# Altium schematic sheet devices.SchDoc
size A3
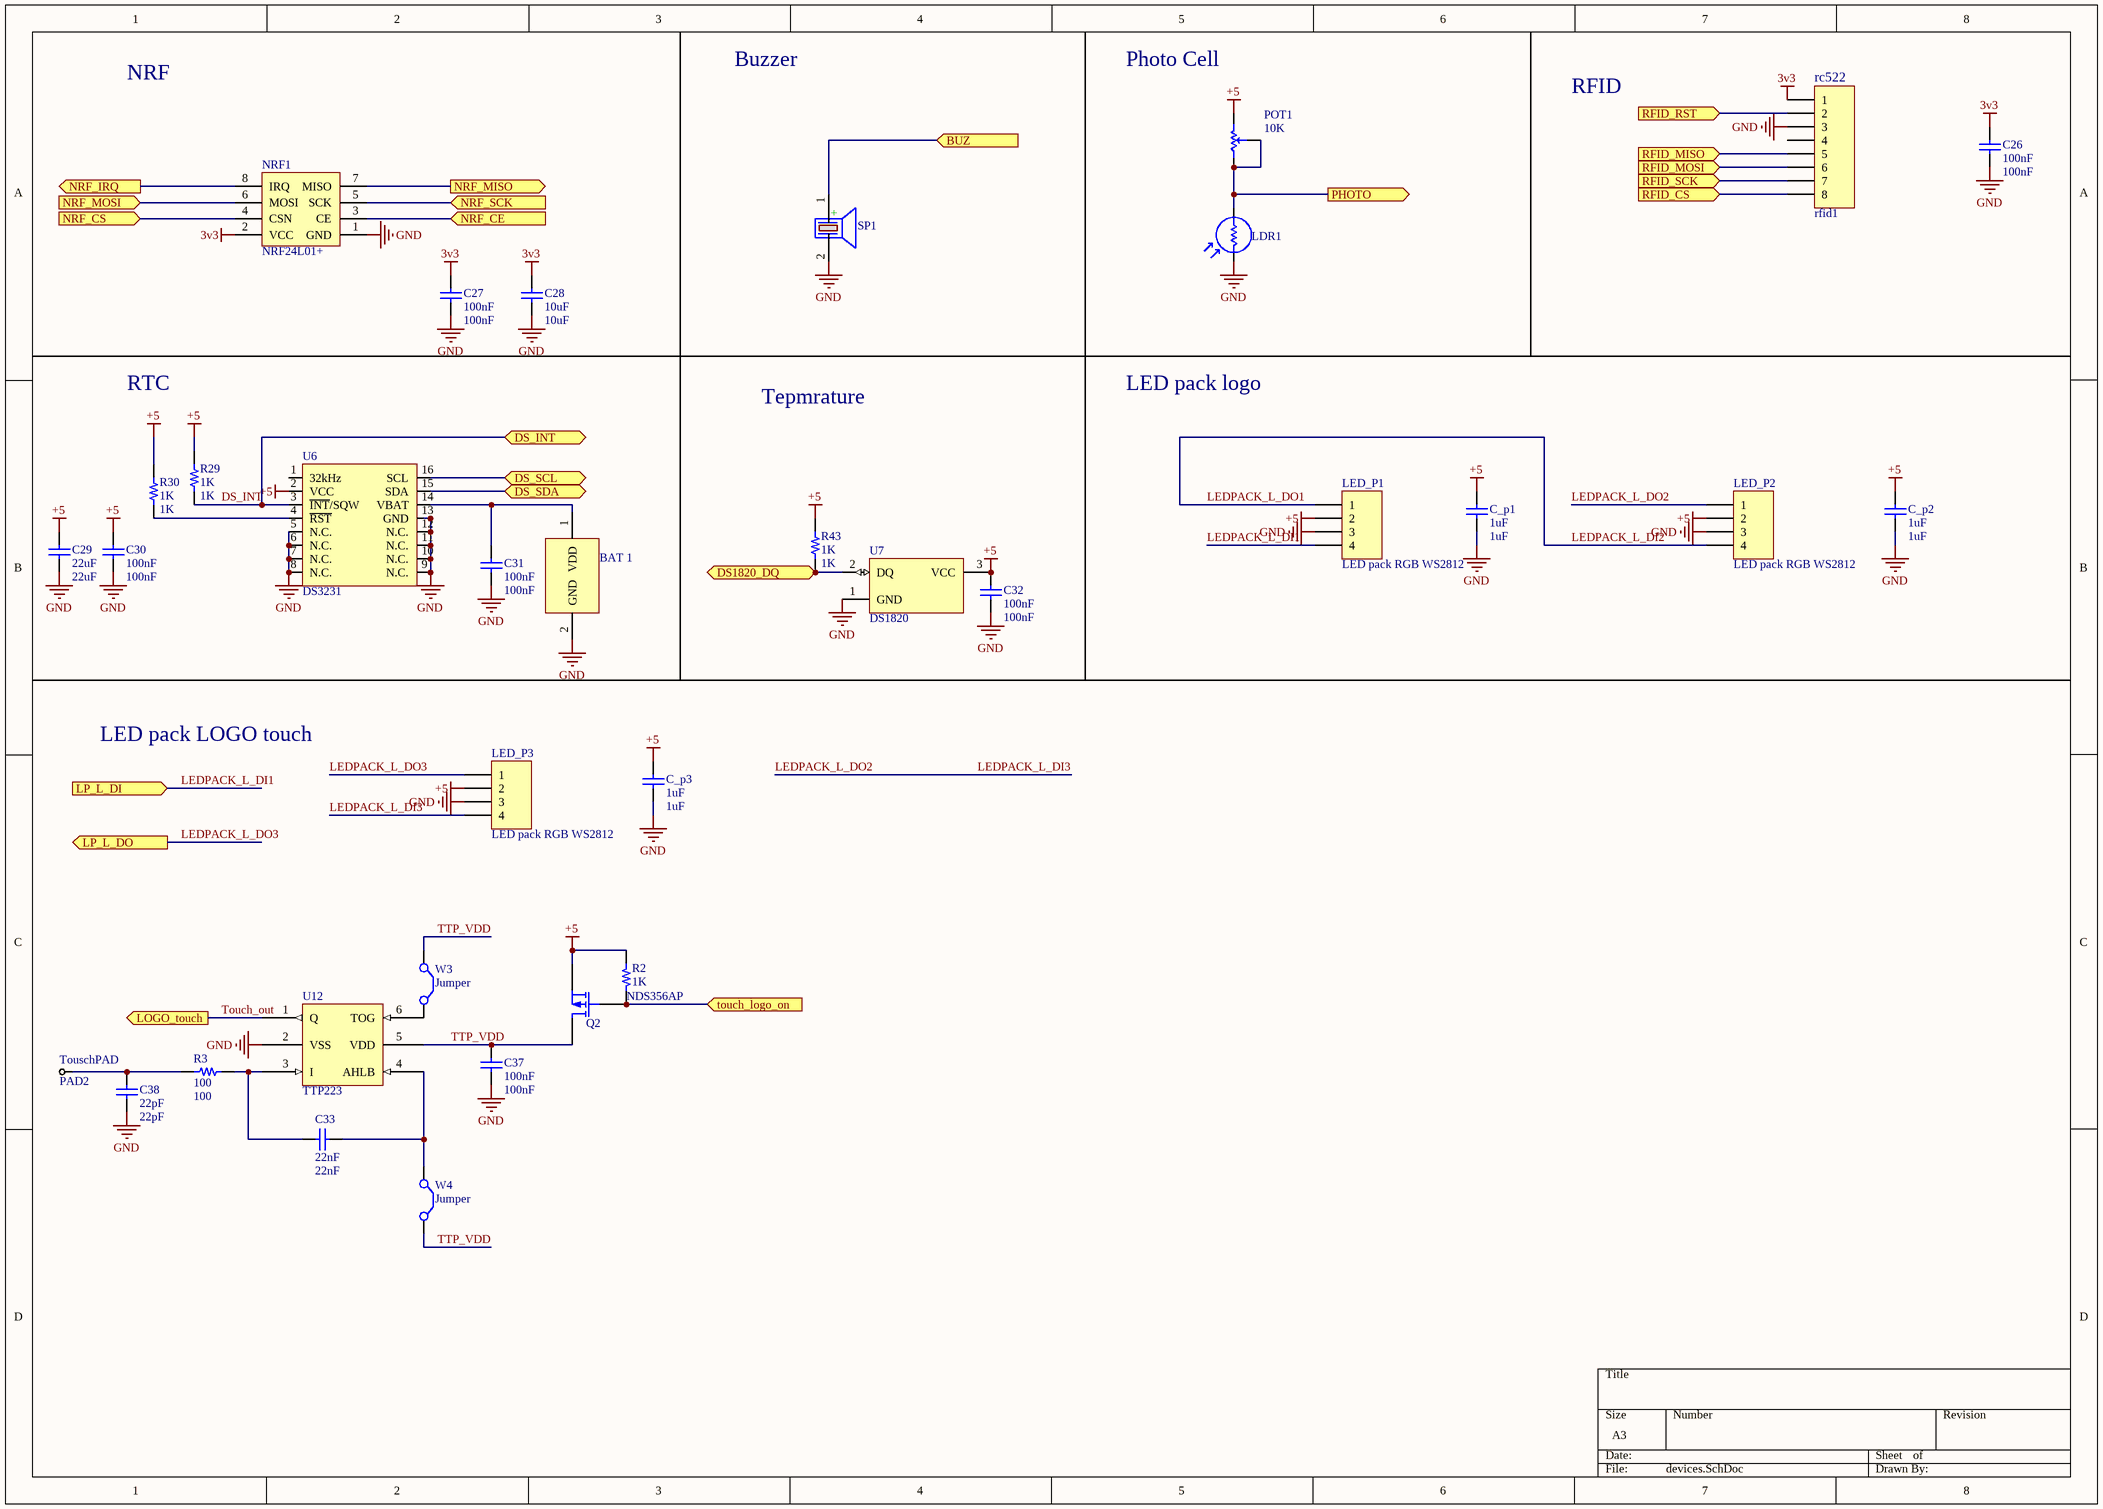
[diagram p0: devices.SchDoc]

## Parts
BAT_1  BAT Backup  [BATTERY_coin]  (value not drawn)
C26  100nF  [0603C]
C27  100nF  [0603C]
C28  10uF  [0603C]
C29  22uF  [0603C]
C30  100nF  [0603C]
C31  100nF  [0603C]
C32  100nF  [0603C]
C33  22nF  [0603C]
C37  100nF  [0603C]
C38  22pF  [0603C]
C_p1  1uF  [0603C]
C_p2  1uF  [0603C]
C_p3  1uF  [0603C]
LDR1  PhotoCell-5mm  [PhotoCell]  (value not drawn)
LED_P1  LED pack RGB WS2812  [PACK77-2121]  (no BOM)
LED_P2  LED pack RGB WS2812  [PACK95.4-2121]  (no BOM)
LED_P3  LED pack RGB WS2812  [pack21-2121]  (no BOM)
NRF1  NRF24L01+  [NRF24L01P]
PAD2  TouschPAD  [touchPAD3]  (no BOM)
POT1  10K  [POT 2]
Q2  NDS356AP  [soT95p280x130-3n]
R2  1K  [0603R]
R3  100  [0603R]
R29  1K  [0603R]
R30  1K  [0603R]
R43  1K  [0603R]
rfid1  H-1x8  [RCC522-rfID-2]  (value not drawn)
SP1  BUZZER  [BUZZER 7.62mm DC]  (value not drawn)
U6  DS3231  [SO-16W]
U7  DS1820  [DS1820]
U12  TTP223  [SOT23-6_L]
W3  Jumper  [JUMPER]  (no BOM)
W4  Jumper  [JUMPER]  (no BOM)

## Ports
BUZ (in), DS1820_DQ (bidir), DS_INT (bidir), DS_SCL (bidir), DS_SDA (bidir), LOGO_touch (out), LP_L_DI (in), LP_L_DO (out), NRF_CE (in), NRF_CS (in), NRF_IRQ (out), NRF_MISO (out), NRF_MOSI (in), NRF_SCK (in), PHOTO (out), RFID_CS (in), RFID_MISO (in), RFID_MOSI (in), RFID_RST (in), RFID_SCK (in), touch_logo_on (in)

## Nets
3v3: C26.2 C27.2 C28.2 NRF1.2(VCC) rfid1.1
+5: C29.2 C30.2 C32.2 C_p1.2 C_p2.2 C_p3.2 LED_P1.2 LED_P2.2 LED_P3.2 POT1.2(CW) Q2.3(S) R2.1 R29.2 R30.2 R43.2 U6.2(VCC) U7.3(VCC)
GND: BAT_1.2(GND) C26.1 C27.1 C28.1 C29.1 C30.1 C31.1 C32.1 C37.1 C38.1 C_p1.1 C_p2.1 C_p3.1 LDR1.1 LED_P1.3 LED_P2.3 LED_P3.3 NRF1.1(GND) rfid1.3 SP1.2(-) U6.5(N.C.) U6.6(N.C.) U6.7(N.C.) U6.8(N.C.) U6.9(N.C.) U6.10(N.C.) U6.11(N.C.) U6.12(N.C.) U6.13(GND) U7.1(GND) U12.2(VSS)
BUZ: SP1.1(+) ; port BUZ
DS1820_DQ: R43.1 U7.2(DQ) ; port DS1820_DQ
DS_INT: R29.1 U6.3(~{INT}/SQW) ; port DS_INT
DS_SCL: U6.16(SCL) ; port DS_SCL
DS_SDA: U6.15(SDA) ; port DS_SDA
LEDPACK_L_DI1: LED_P1.4 ; port LP_L_DI
LEDPACK_L_DI2: LED_P1.1 LED_P2.4  [also labelled LEDPACK_L_DO1]
LEDPACK_L_DI3: LED_P2.1 LED_P3.4  [also labelled LEDPACK_L_DO2]
LEDPACK_L_DO3: LED_P3.1 ; port LP_L_DO
NRF_CE: NRF1.3(CE) ; port NRF_CE
NRF_CS: NRF1.4(CSN) ; port NRF_CS
NRF_IRQ: NRF1.8(IRQ) ; port NRF_IRQ
NRF_MISO: NRF1.7(MISO) ; port NRF_MISO
NRF_MOSI: NRF1.6(MOSI) ; port NRF_MOSI
NRF_SCK: NRF1.5(SCK) ; port NRF_SCK
PHOTO: LDR1.2 POT1.1(CCW) POT1.3(SetPoint) ; port PHOTO
RFID_CS: rfid1.8 ; port RFID_CS
RFID_MISO: rfid1.5 ; port RFID_MISO
RFID_MOSI: rfid1.6 ; port RFID_MOSI
RFID_RST: rfid1.2 ; port RFID_RST
RFID_SCK: rfid1.7 ; port RFID_SCK
touch_logo_on: Q2.2(G) R2.2 ; port touch_logo_on
Touch_out: U12.1(Q) ; port LOGO_touch
TTP_VDD: C37.2 Q2.1(D) U12.5(VDD) W3.1(C1) W4.2(C2)
NetBAT_1_1: BAT_1.1(VDD) C31.2 U6.14(VBAT)
NetC33_1: C33.1 U12.4(AHLB) W4.1(C1)
NetC33_2: C33.2 R3.1 U12.3(I)
NetC38_2: C38.2 PAD2.1(T) R3.2
NetR30_1: R30.1 U6.4(~{RST})
NetU12_6: U12.6(TOG) W3.2(C2)

Not connected (* = marked no-connect by the designer): rfid1 4; U6 1(32kHz)

## Notes on the sheet
- NRF
- Buzzer
- Photo Cell
- RFID
- (near rfid1) rc522
- RTC
- Tepmrature
- LED pack logo
- LED pack LOGO touch

## Library data of the parts
BAT_1 = BAT Backup: COIN CELL BATTERY CR1220
C26-C32 C37 C_p1-C_p3 = Cap: CAP SMD 0603; Published: 8-Jun-2000; LatestRevisionDate: 17-Jul-2002; LatestRevisionNote: Re-released for DXP Platform.; PackageReference: RAD-0.3; Publisher: Altium Limited; PackageDescription: Radial Cap, Thru-Hole; 2 Leads; 0.3 in Pin Spacing
  C26 C27 C30-C32 C37: Value: 100nF
  C28: Value: 10uF
  C29: Value: 22uF
  C_p1-C_p3: Value: 1uF
C33 C38 = Cap: X7R_NPO; Published: 8-Jun-2000; LatestRevisionDate: 17-Jul-2002; LatestRevisionNote: Re-released for DXP Platform.; PackageReference: RAD-0.3; Publisher: Altium Limited; PackageDescription: Radial Cap, Thru-Hole; 2 Leads; 0.3 in Pin Spacing
  C33: Value: 22nF
  C38: Value: 22pF
LDR1 = LDR: Photo Cell- Variable Resistor With Light; Company: IPA CO.; Designer: Saeid Jorablo; Last Update Time: 2008/07/17
LED_P1 = Header 4: 19RGB LED pack; LatestRevisionDate: 17-Jul-2002; LatestRevisionNote: Re-released for DXP Platform.; Publisher: Altium Limited
LED_P2 = Header 4: 23 RGB LED pack; LatestRevisionDate: 17-Jul-2002; LatestRevisionNote: Re-released for DXP Platform.; Publisher: Altium Limited
LED_P3 = Header 4: 5 RGB LED pack; LatestRevisionDate: 17-Jul-2002; LatestRevisionNote: Re-released for DXP Platform.; Publisher: Altium Limited
NRF1 = NRF24L01P: NRF Module; Ali Hafizi: Creature
PAD2 = Test Point
POT1 = POT: Variable Resistor; Value: 10K
Q2 = MOSFET-P: P-Channel MOSFET SOT23; pin to pad: 1>3 2>1 3>2; Published: 8-Jun-2000; LatestRevisionDate: 17-Jul-2002; LatestRevisionNote: Re-released for DXP Platform.; PackageVersion: 1995/1996; PackageReference: E3; Publisher: Altium Limited; PackageDescription: TO, Flat Index; 3 In-Line, Axial Leads; Body Dia. 4.6mm; Lead Dia. 0.5 mm (max)
R2 R3 R29 R30 R43 = Resistor: RES SMD 0603; Part Number: RCS0805100KFKEA
  R2 R29 R30 R43: Value: 1K
  R3: Value: 100
SP1 = PIEZO BUZZER: PIEZO BUZZER 5VOLTS; Designer: Abbas Basereh; Comment_1: SPEAKER AND BEEP; Design Date: 1395/11/14; ComponentLink2Description: Reference; PackageDescription: THD; Publisher: Abbas Basereh; Mounting Technology: THD; Pin Count: 2; Status: Unreleased
U6 = DS3231: DS3231 RTC
U7 = DS1820: 1-Wire Digital Thermometer; ComponentAvailability: Obsolete; Published: 13-Oct-2000; LatestRevisionDate: 17-Jul-2002; LatestRevisionNote: Re-released for DXP Platform.; DatasheetVersion: 5-Mar-1998; PackageVersion: 1999; PackageReference: PR35; Publisher: Altium Limited; PackageDescription: TO, Flat Index; 3 In-Line, Axial Leads; Body Dia. 4.6mm; Leads 0.56 x 0.51 mm (max); ComponentLink1Description: Manufacturer Link; ComponentLink1URL: http://www.maxim-ic.com/; ComponentLink2Description: Datasheet; ComponentLink2URL: http://pdfserv.maxim-ic.com/en/ds/DS1820-DS1820S.pdf; ComponentLink3Description: Discontinuation Notice; ComponentLink3URL: http://www.maxim-ic.com/qa/pdfs/non-obsolescence-letter.pdf
U12 = ttp223b: capacitive touch IC
W3 W4 = Jumper: Jumper Wire; Published: 24-Mar-1999; LatestRevisionDate: 17-Jul-2002; LatestRevisionNote: Re-released for DXP Platform.; PackageReference: RAD-0.2; Publisher: Altium Limited; PackageDescription: Radial Cap, Thru-Hole; 2 Leads; 0.2 in Pin Spacing